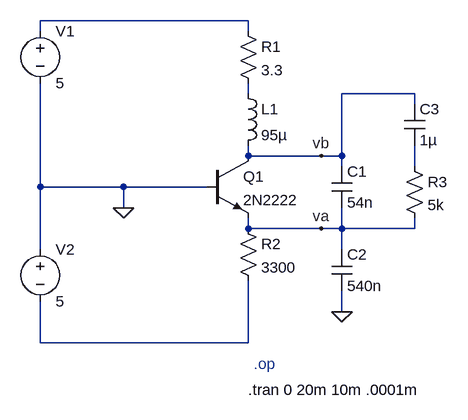
[diagram p0: schematic prueba c.asc]
prueba c.asc, the LTspice schematic file:
Version 4
SHEET 1 968 680
WIRE 224 -80 -96 -80
WIRE -96 -64 -96 -80
WIRE 224 -64 224 -80
WIRE 224 32 224 16
WIRE 480 32 368 32
WIRE 480 48 480 32
WIRE 224 128 224 112
WIRE 336 128 224 128
WIRE 368 128 368 32
WIRE 368 128 336 128
WIRE 368 144 368 128
WIRE 480 144 480 112
WIRE -96 176 -96 16
WIRE 32 176 -96 176
WIRE 160 176 32 176
WIRE 32 208 32 176
WIRE 224 240 224 224
WIRE 336 240 224 240
WIRE 368 240 368 208
WIRE 368 240 336 240
WIRE 480 240 480 224
WIRE 480 240 368 240
WIRE -96 272 -96 176
WIRE 368 272 368 240
WIRE 368 368 368 336
WIRE -96 416 -96 352
WIRE 224 416 224 320
WIRE 224 416 -96 416
FLAG 368 368 0
FLAG 32 208 0
FLAG 336 240 va
FLAG 336 128 vb
SYMBOL npn 160 128 R0
SYMATTR InstName Q1
SYMATTR Value 2N2222
SYMBOL ind 208 16 R0
SYMATTR InstName L1
SYMATTR Value 95µ
SYMBOL res 208 -80 R0
SYMATTR InstName R1
SYMATTR Value 3.3
SYMBOL res 208 224 R0
SYMATTR InstName R2
SYMATTR Value 3300
SYMBOL cap 352 144 R0
SYMATTR InstName C1
SYMATTR Value 54n
SYMBOL cap 352 272 R0
SYMATTR InstName C2
SYMATTR Value 540n
SYMBOL voltage -96 -80 R0
WINDOW 123 0 0 Left 2
WINDOW 39 0 0 Left 2
SYMATTR InstName V1
SYMATTR Value 5
SYMBOL voltage -96 256 R0
WINDOW 123 0 0 Left 2
WINDOW 39 0 0 Left 2
SYMATTR InstName V2
SYMATTR Value 5
SYMBOL res 464 128 R0
SYMATTR InstName R3
SYMATTR Value 5k
SYMBOL cap 464 48 R0
SYMATTR InstName C3
SYMATTR Value 1µ
TEXT 224 488 Left 2 !.tran 0 20m 10m .0001m
TEXT 232 448 Left 2 ;.op

The netlist it stands for:
* prueba c.asc
Q1 vb 0 va 0 2N2222
L1 N002 vb 95µ
R1 N001 N002 3.3
R2 va N004 3300
C1 vb va 54n
C2 va 0 540n
V1 N001 0 5
V2 0 N004 5
R3 N003 va 5k
C3 vb N003 1µ
.model NPN NPN
.model PNP PNP
.lib standard.bjt
.tran 0 20m 10m .0001m
* .op
.backanno
.end